# EAGLE design 3digis-led (EAGLE 5.07)
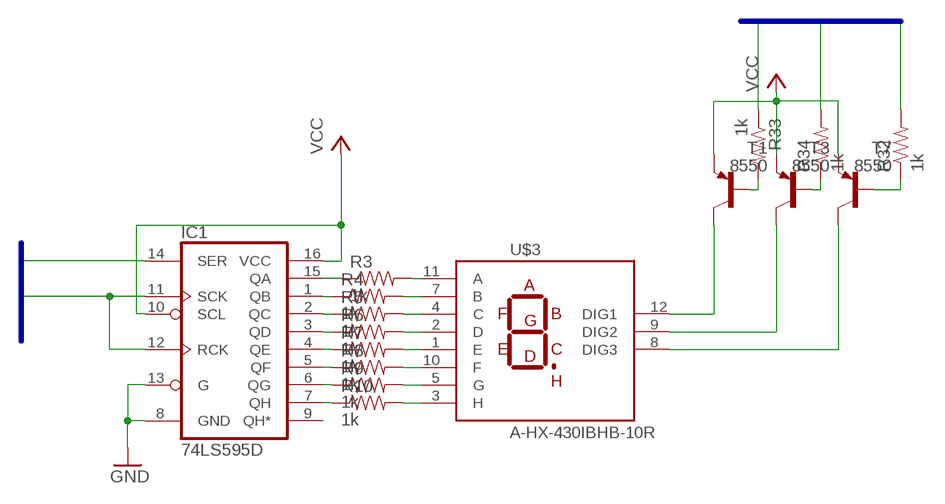
[diagram p0: schematic, sheet 1]

## Parts
IC1  74LS595D  [SO16]
R3  1k  RESISTOR0805  [0805]
R4  1k  RESISTOR0805  [0805]
R5  1k  RESISTOR0805  [0805]
R6  1k  RESISTOR0805  [0805]
R7  1k  RESISTOR0805  [0805]
R8  1k  RESISTOR0805  [0805]
R9  1k  RESISTOR0805  [0805]
R10  1k  RESISTOR0805  [0805]
R32  1k  RESISTOR0805  [0805]
R33  1k  RESISTOR0805  [0805]
R34  1k  RESISTOR0805  [0805]
T1  8550  -PNP-SOT23-BEC  [SOT23-BEC]
T3  8550  -PNP-SOT23-BEC  [SOT23-BEC]
T7  8550  -PNP-SOT23-BEC  [SOT23-BEC]
U$3  A-HX-430IBHB-10R  [A-HX430-30MMX16MM]

## Nets
GND: IC1.8(GND) IC1.13(G)
MISO: R34.2
MOSI: R32.2
N$6: IC1.15(QA) R3.1
N$7: IC1.1(QB) R4.1
N$8: IC1.2(QC) R5.1
N$9: IC1.3(QD) R6.1
N$10: IC1.4(QE) R7.1
N$12: IC1.5(QF) R8.1
N$13: IC1.6(QG) R9.1
N$14: R9.2 U$3.5(G)
N$17: IC1.7(QH) R10.1
N$18: R10.2 U$3.3(H)
N$19: R8.2 U$3.10(F)
N$20: R7.2 U$3.1(E)
N$21: R6.2 U$3.2(D)
N$22: R5.2 U$3.4(C)
N$23: R4.2 U$3.7(B)
N$24: R3.2 U$3.11(A)
N$60: R32.1 T7.B
N$61: T1.C U$3.12(DIG1)
N$62: T3.C U$3.9(DIG2)
N$63: T7.C U$3.8(DIG3)
N$64: R34.1 T3.B
N$65: R33.2 T1.B
PC0: IC1.14(SER)
PC1: IC1.11(SCK) IC1.12(RCK)
SCK: R33.1
VCC: IC1.10(SCL) IC1.16(VCC) T1.E T3.E T7.E
Unconnected: IC1.9(QH*)

## Buses
B$3
B$4

## Library data of the parts
IC1 = SparkFun:74*595: 8-bit SHIFT REGISTER, output latch
R3-R10 R32-R34 = digital-toy:RESISTOR: Resistor Basic schematic elements and footprints for 0603, 1206, and PTH 1/10th watt (small) resistors.
T1 T3 T7 = digital-toy:*-PNP-: PNP Transistror
U$3 = led-seg:A-HX-430IBHB-10R: Xuyang ShenZhen common anode 3 digit 7 segment led 30mmX16mm 7mm Hight (2.54mm pin) silk name: hx-430ibhb-10r by hyl, heyongli@gmail.com 2010-6-3

## Board
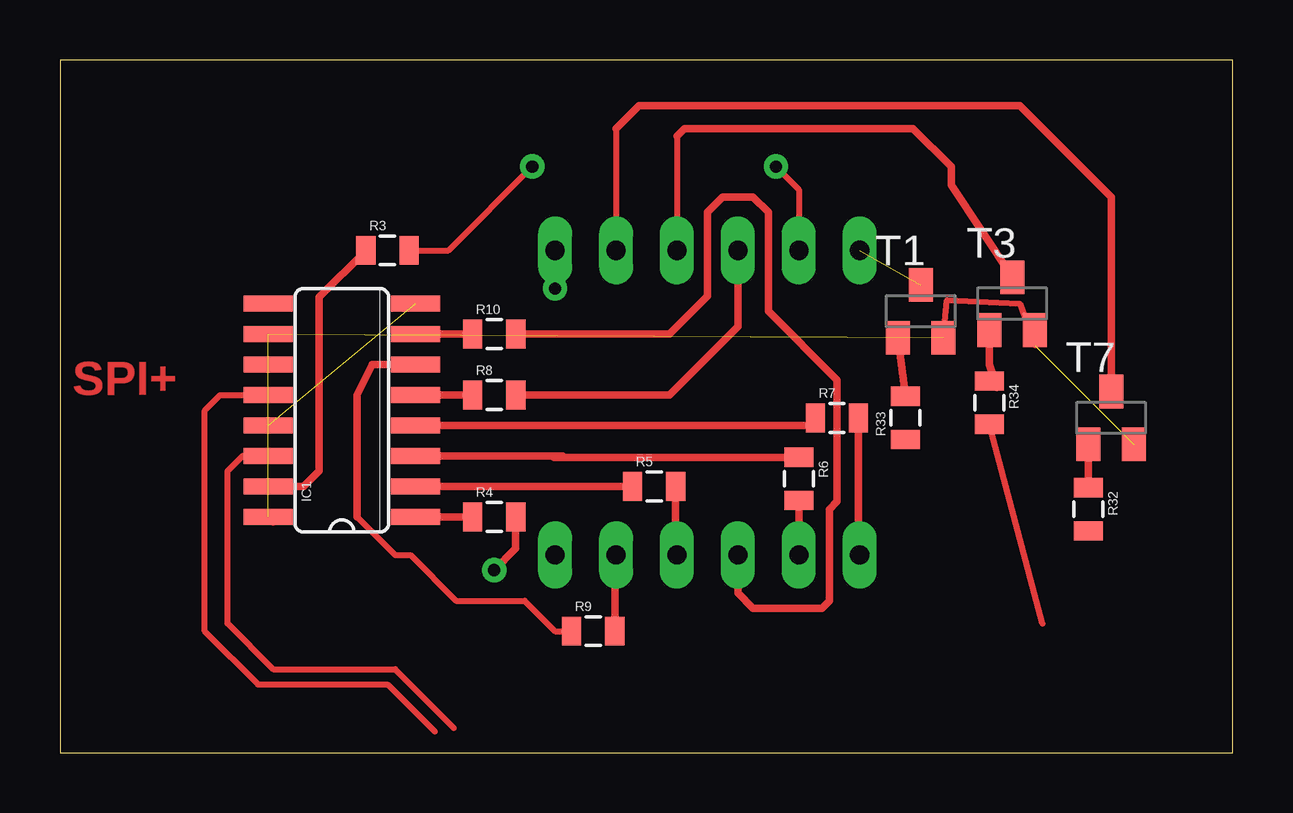
[diagram p1: board, top side]
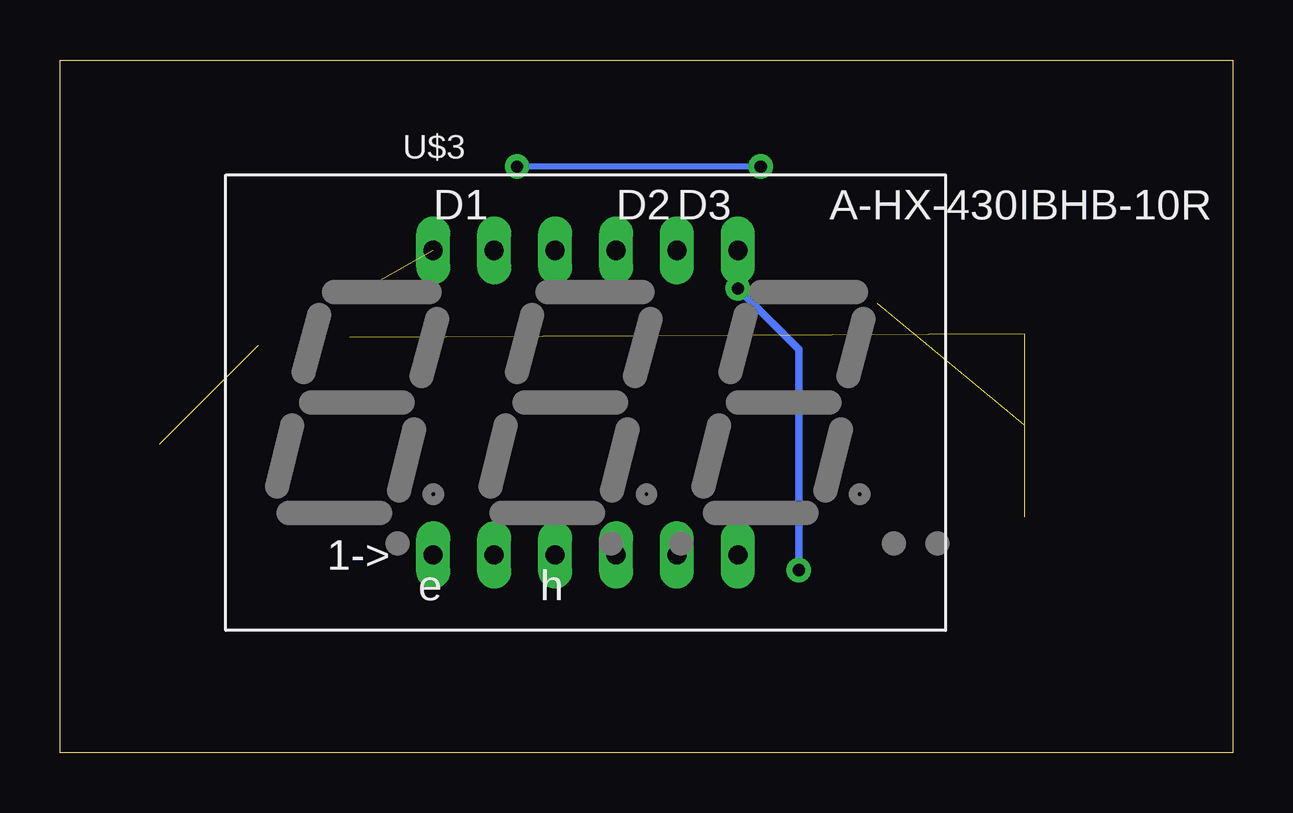
[diagram p2: board, bottom side, seen from below]

Size 48.9 x 28.89 mm. Coordinates in mm from the lower left corner, seen from the top.
Outline: 0,0 48.9,0 48.9,28.89 0,28.89 0,0
Copper layers (1*16): Top 0.035mm / dielectric 1.5mm / Bottom 0.035mm
Design rules "SparkFun": minimum track width 8mil, minimum drill 20mil, track to track 8mil, track to pad 8mil, pad to pad 8mil, via to via 8mil, smd to smd 8mil, copper to edge 10mil, drill to drill 8mil, minimum pad ring 12mil, minimum via ring 10mil, stop-mask expansion 4mil, vias tented up to drill 25mil, thermal gap 10mil

### Footprints (pad centres in the part's own frame; a part is rotated, then mirrored left to right if it is on the bottom)
SO16 = smd 0.66 x 2.032: 1 -4.445,-3.073; 2 -3.175,-3.073; 3 -1.905,-3.073; 4 -0.635,-3.073; 5 0.635,-3.073; 6 1.905,-3.073; 7 3.175,-3.073; 8 4.445,-3.073; 9 4.445,3.073; 10 3.175,3.073; 11 1.905,3.073; 12 0.635,3.073; 13 -0.635,3.073; 14 -1.905,3.073; 15 -3.175,3.073; 16 -4.445,3.073
0805 = smd 0.8 x 1.2: 1 -0.9,0; 2 0.9,0
SOT23-BEC = smd 1 x 1.4: B -0.95,-1.1; C 0,1.1; E 0.95,-1.1
A-HX430-30MMX16MM = drill 0.8 long: 1 -6.35,-6.35; 2 -3.81,-6.35; 3 -1.27,-6.35; 4 1.27,-6.35; 5 3.81,-6.35; 6 6.35,-6.35; 7 6.35,6.35; 8 3.81,6.35; 9 1.27,6.35; 10 -1.27,6.35; 11 -3.81,6.35; 12 -6.35,6.35

### Placement (x,y rotation side)
IC1  11.75,14.29 90 top
R3  13.65,20.95 0 top
R4  18.1,9.84 0 top
R5  24.77,11.11 0 top
R6  30.8,11.43 270 top
R7  32.38,13.97 0 top
R8  18.1,14.92 0 top
R9  22.23,5.08 0 top
R10  18.1,17.46 0 top
R32  42.86,10.16 270 top
R33  35.24,13.97 90 top
R34  38.73,14.61 270 top
T1  35.88,18.41 0 top
T3  39.69,18.73 0 top
T7  43.81,13.97 0 top
U$3  26.99,14.61 0 bottom

### Tracks (layer width: path | path; a pad name or v marks a point on that pad's centre or on a via)
GND  (1 unrouted)
MISO
  Top 0.254: 40.96,5.4 R34.2
N$6
  Top 0.305: IC1.15 10.16,11.11 10.79,11.75 10.79,19 R3.1
N$7
  Top 0.305: IC1.1 R4.1
N$8
  Top 0.305: IC1.2 R5.1
N$9
  Top 0.305: R6.1 20.59,12.33 20.95,12.38 IC1.3
N$10
  Top 0.305: IC1.4 31.43,13.65 R7.1
N$12
  Top 0.305: IC1.5 R8.1
N$13
  Top 0.254: R9.1 20.64,5.08 19.37,6.35 16.51,6.35 14.61,8.26 13.97,8.26 12.38,9.84
  Top 0.305: IC1.6 13.02,16.19 12.38,14.92 12.38,9.84
N$14
  Top 0.305: R9.2 23.12,8.2 U$3.5
N$17
  Top 0.305: IC1.7 R10.1
N$18
  Top 0.305: R10.2 25.4,17.46 26.99,19.05 26.99,22.54 27.62,23.18 28.89,23.18 29.53,22.54 29.53,18.41 32.38,15.56 32.38,10.48 32.07,10.16 32.07,6.35 31.75,6.03 28.89,6.03 28.26,6.67 U$3.3
N$19
  Top 0.305: R8.2 25.4,14.92 28.26,17.78 U$3.10
N$20
  Top 0.305: R7.2 33.28,8.31 U$3.1
N$21
  Top 0.305: U$3.2 R6.2
N$22
  Top 0.305: R5.2 25.66,8.31 U$3.4
N$23  (via drill 0.51)
  Top 0.305: R4.2 19,8.52 v18.1,7.62 | v20.64,19.37 U$3.7
  Bottom 0.305: v18.1,7.62 18.1,16.83 v20.64,19.37
N$24  (via drill 0.51)
  Top 0.254: R3.2 16.19,20.95 v19.68,24.45 | v29.84,24.45 30.8,23.5 U$3.11
  Bottom 0.254: v19.68,24.45 v29.84,24.45
N$60
  Top 0.305: T7.B 42.87,11.38 R32.1
N$61  (1 unrouted)
N$62
  Top 0.254: 25.72,25.72 U$3.9
  Top 0.305: 25.72,25.72 26.04,26.04 35.56,26.04 37.15,24.45 37.15,23.66 T3.C
N$63
  Top 0.254: 23.18,26.04 U$3.8
  Top 0.305: 23.18,26.04 24.13,26.99 40.01,26.99 43.81,23.18 T7.C
N$64
  Top 0.305: T3.B 38.73,16.2 39.05,15.24 R34.1
N$65
  Top 0.305: T1.B 35.19,15.24 R33.2
PC0
  Top 0.254: 16.41,1.05 13.97,3.49 8.89,3.49 6.99,5.4 6.99,11.75 7.62,12.38 IC1.14
PC1  (1 unrouted)
  Top 0.254: 15.62,0.9 13.65,2.86 8.26,2.86 6.03,5.08 6.03,14.29 6.67,14.92 IC1.12
VCC  (3 unrouted)
  Top 0.254: T1.E 36.98,18.88 40.01,18.73 40.64,17 T3.E
  Top 0.305: IC1.16 8.89,9.63

### Text on the board
Top: SPI+
Document: AREF | GND | PB5 | PB4 | PB3 | PB2 | PB1 | PB0 | PD7 | PD6 | PD5 | PD4 | PD3 | PD2 | PD1 | PD0 | !Reset | +3V3 | +5V | GND | GND | +Vin | PC0 | PC1 | PC2 | PC3 | PC4 | PC5